# Altium project Buck_Converter_10A.PrjPcb
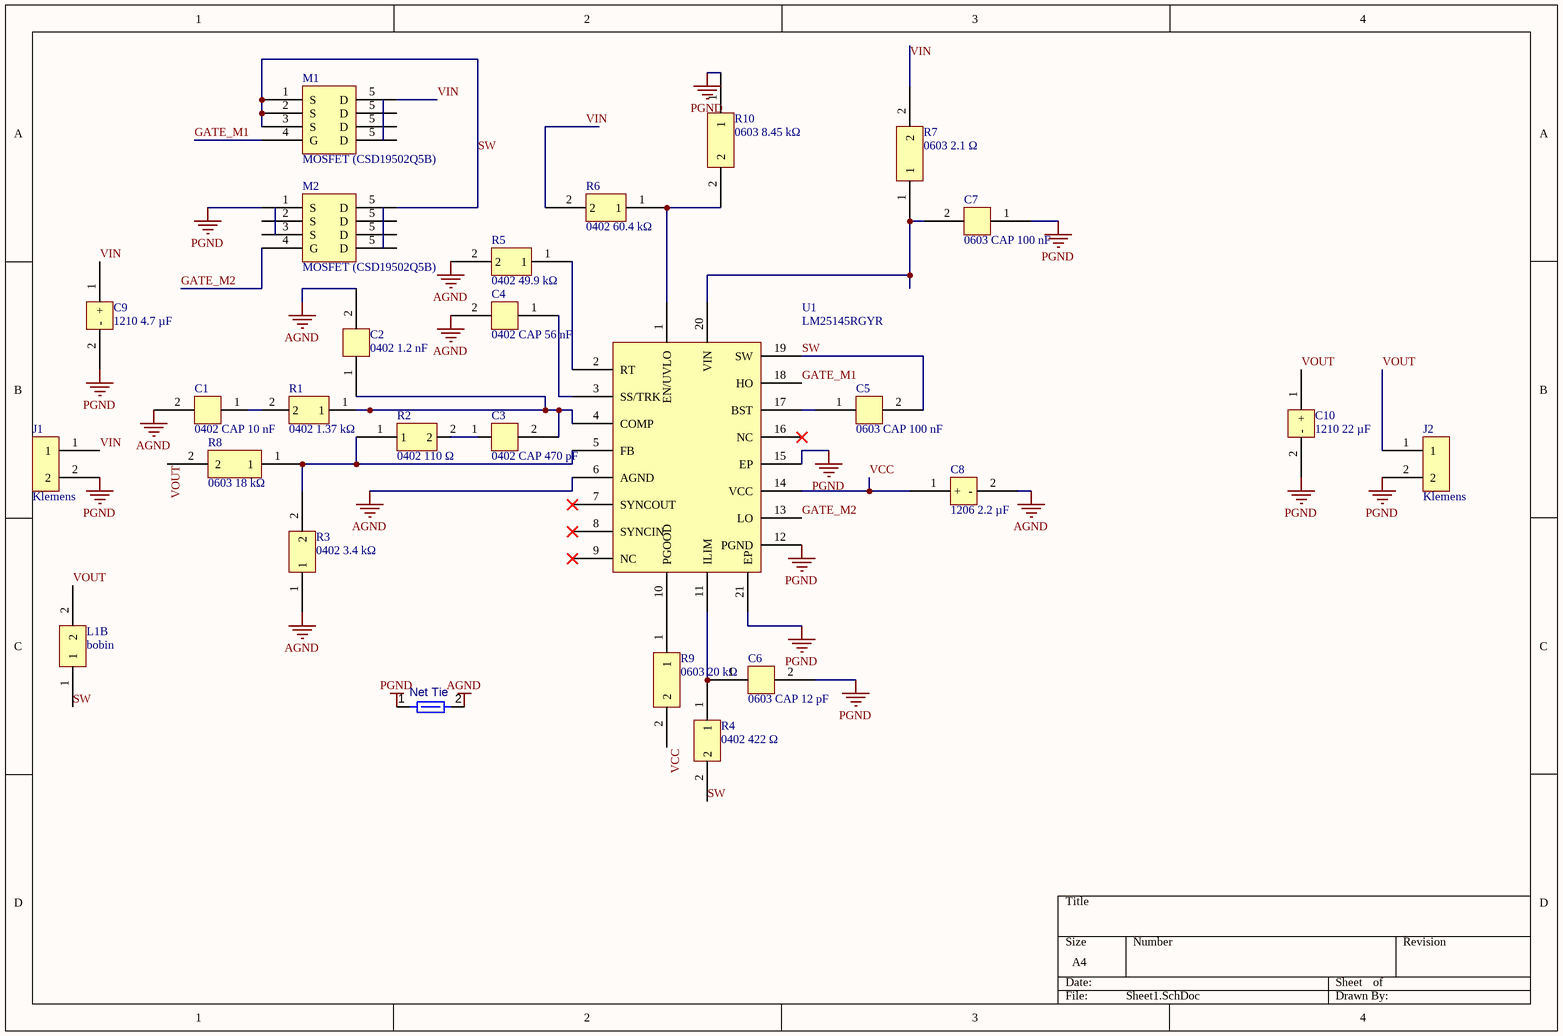
[diagram p0: Sheet1.SchDoc]
1 sheet, 27 parts. Net scope: global (net labels, ports and power ports of the same name join across sheets).
Board file: Buck_Converter_10A.PcbDoc

## Sheet Sheet1.SchDoc
size A4; SheetNumber: 1; SheetTotal: 1

### Parts
C1  0402 CAP 10 nF  [RESC1005X06N]
C2  0402 1.2 nF  [RESC1005X06N]
C3  0402 CAP 470 pF  [RESC1005X06N]
C4  0402 CAP 56 nF  [RESC1005X06N]
C5  0603 CAP 100 nF  [RESC1608X06N]
C6  0603 CAP 12 pF  [RESC1608X06N]
C7  0603 CAP 100 nF  [RESC1608X06N]
C8  1206 2.2 µF  [1206 (Orta Boy Seramik)]
C9  1210 4.7 µF  [1210 (En Büyük Seramik)]
C10  1210 22 µF  [1210 (En Büyük Seramik)]
J1  Klemens  [Klemens]
J2  Klemens  [Klemens]
L1  bobin  [INDM150150X100N]  (part B of 2)
M1  MOSFET (CSD19502Q5B)  [MOSFET+]
M2  MOSFET (CSD19502Q5B)  [MOSFET+]
Net_Tie  Net Tie 10x8mil  [New footprint 1]  (value not drawn)  (net tie, no BOM)
R1  0402 1.37 kΩ  [RESC1608X06N]
R2  0402 110 Ω  [RESC1608X06N]
R3  0402 3.4 kΩ  [RESC1608X06N]
R4  0402 422 Ω  [RESC1608X06N]
R5  0402 49.9 kΩ  [RESC1608X06N]
R6  0402 60.4 kΩ  [RESC1608X06N]
R7  0603 2.1 Ω  [RESC1608X06N]
R8  0603 18 kΩ  [RESC1608X06N]
R9  0603 20 kΩ  [RESC1608X06N]
R10  0603 8.45 kΩ  [RESC1608X06N]
U1  LM25145RGYR  [PQFN50P350X450X100_HS-21N]

### Nets
AGND: C1.2 C2.2 C4.2 C8.2(-) Net_Tie.2 R3.1 R5.2 U1.6(AGND)
PGND: C6.2 C7.1 C9.2(-) C10.2(-) J1.2 J2.2 M2.1(S) Net_Tie.1 R10.1 U1.12(PGND) U1.15(EP) U1.21(EP)
GATE_M1: M1.4(G) U1.18(HO)
GATE_M2: M2.4(G) U1.13(LO)
SW: C5.2 L1.1 M1.1(S) M1.2(S) M1.3(S) M2.5(D) R4.2 U1.19(SW)
VCC: C8.1(+) R9.2 U1.14(VCC)
VIN: C9.1(+) J1.1 M1.5(D) R6.2 R7.2
VOUT: C10.1(+) J2.1 L1.2 R8.2
NetC1_1: C1.1 R1.2
NetC2_1: C2.1 C3.2 R1.1 U1.4(COMP)
NetC3_1: C3.1 R2.2
NetC4_1: C4.1 U1.3(SS/TRK)
NetC5_1: C5.1 U1.17(BST)
NetC6_1: C6.1 R4.1 U1.11(ILIM)
NetC7_2: C7.2 R7.1 U1.20(VIN)
NetR2_1: R2.1 R3.2 R8.1 U1.5(FB)
NetR5_1: R5.1 U1.2(RT)
NetR6_1: R6.1 R10.2 U1.1(EN/UVLO)
NetR9_1: R9.1 U1.10(PGOOD)

Not connected (* = marked no-connect by the designer): M2 2(S) 3(S); U1 7(SYNCOUT)* 8(SYNCIN)* 9(NC)* 16(NC)*

### Library data of the parts
C1-C4 = 0402 CAP
C5-C7 = 0603 CAP
C8 = 1206 orta boy kondansatör
C9 C10 = 1210 kondansatör
Net_Tie = CMP-009-00116-2: Min Operating Temperature: -55°C; Pins: 2; Max Operating Temperature: 155°C
R1-R6 = direnç 0402
R7-R10 = direnç